# EAGLE design Esquema (EAGLE 9.6.2)
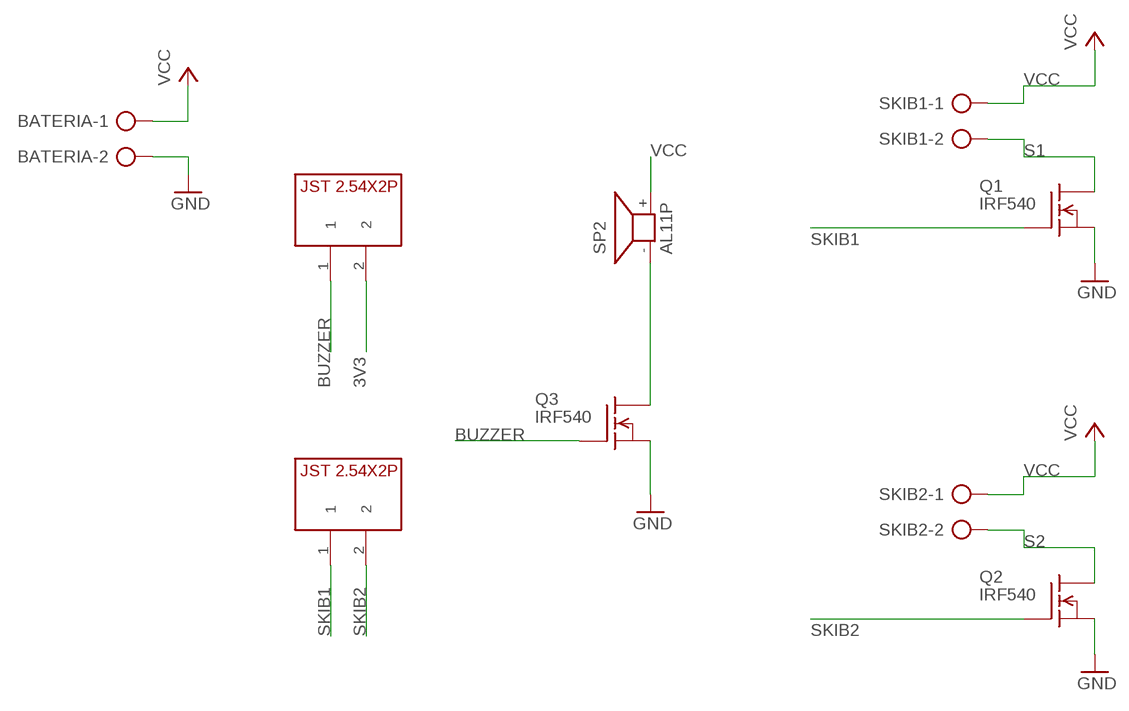
[diagram p0: schematic, sheet 1]

## Parts
BATERIA  AK500/2-H  [AK500/2-H]
Q1  IRF540  [TO220]
Q2  IRF540  [TO220]
Q3  IRF540  [TO220]
SKIB1  AK500/2-H  [AK500/2-H]
SKIB2  AK500/2-H  [AK500/2-H]
SP2  AL11P  [AL11P]
U$1  JST2.54X2P  [JST2.54X2P_FOOTPRINT]
U$2  JST2.54X2P  [JST2.54X2P_FOOTPRINT]

## Nets
3V3: U$1.2
BUZZER: Q3.1(G) U$1.1
GND: BATERIA.2 Q1.3(S) Q2.3(S) Q3.3(S)
N$2: Q3.2(D) SP2.-
S1: Q1.2(D) SKIB1.2
S2: Q2.2(D) SKIB2.2
SKIB1: Q1.1(G) U$2.1
SKIB2: Q2.1(G) U$2.2
VCC: BATERIA.1 SKIB1.1 SKIB2.1 SP2.+

## Library data of the parts
BATERIA SKIB1 SKIB2 = con-ptr500:AK500/2-H: CONNECTOR Aug. 2004 / PTR Meßtechnik: Die Bezeichnung der Serie AK505 wurde geändert. Es handelt sich hierbei um AK500 in horizontaler Ausführung.; OC_FARNELL: unknown; OC_NEWARK: unknown
Q1-Q3 = transistor-fet:IRF540: N-Channel Enhancement MOSFET (HEXFET); 100V; 28A; 0,077Ohm
SP2 = buzzer:AL11P: SPEAKER Source: Buerklin; OC_FARNELL: unknown; OC_NEWARK: unknown
U$1 U$2 = CRD:JST2.54X2P: Conector JST 2 pinos (2.54mm de distância entre pinos)

## Board
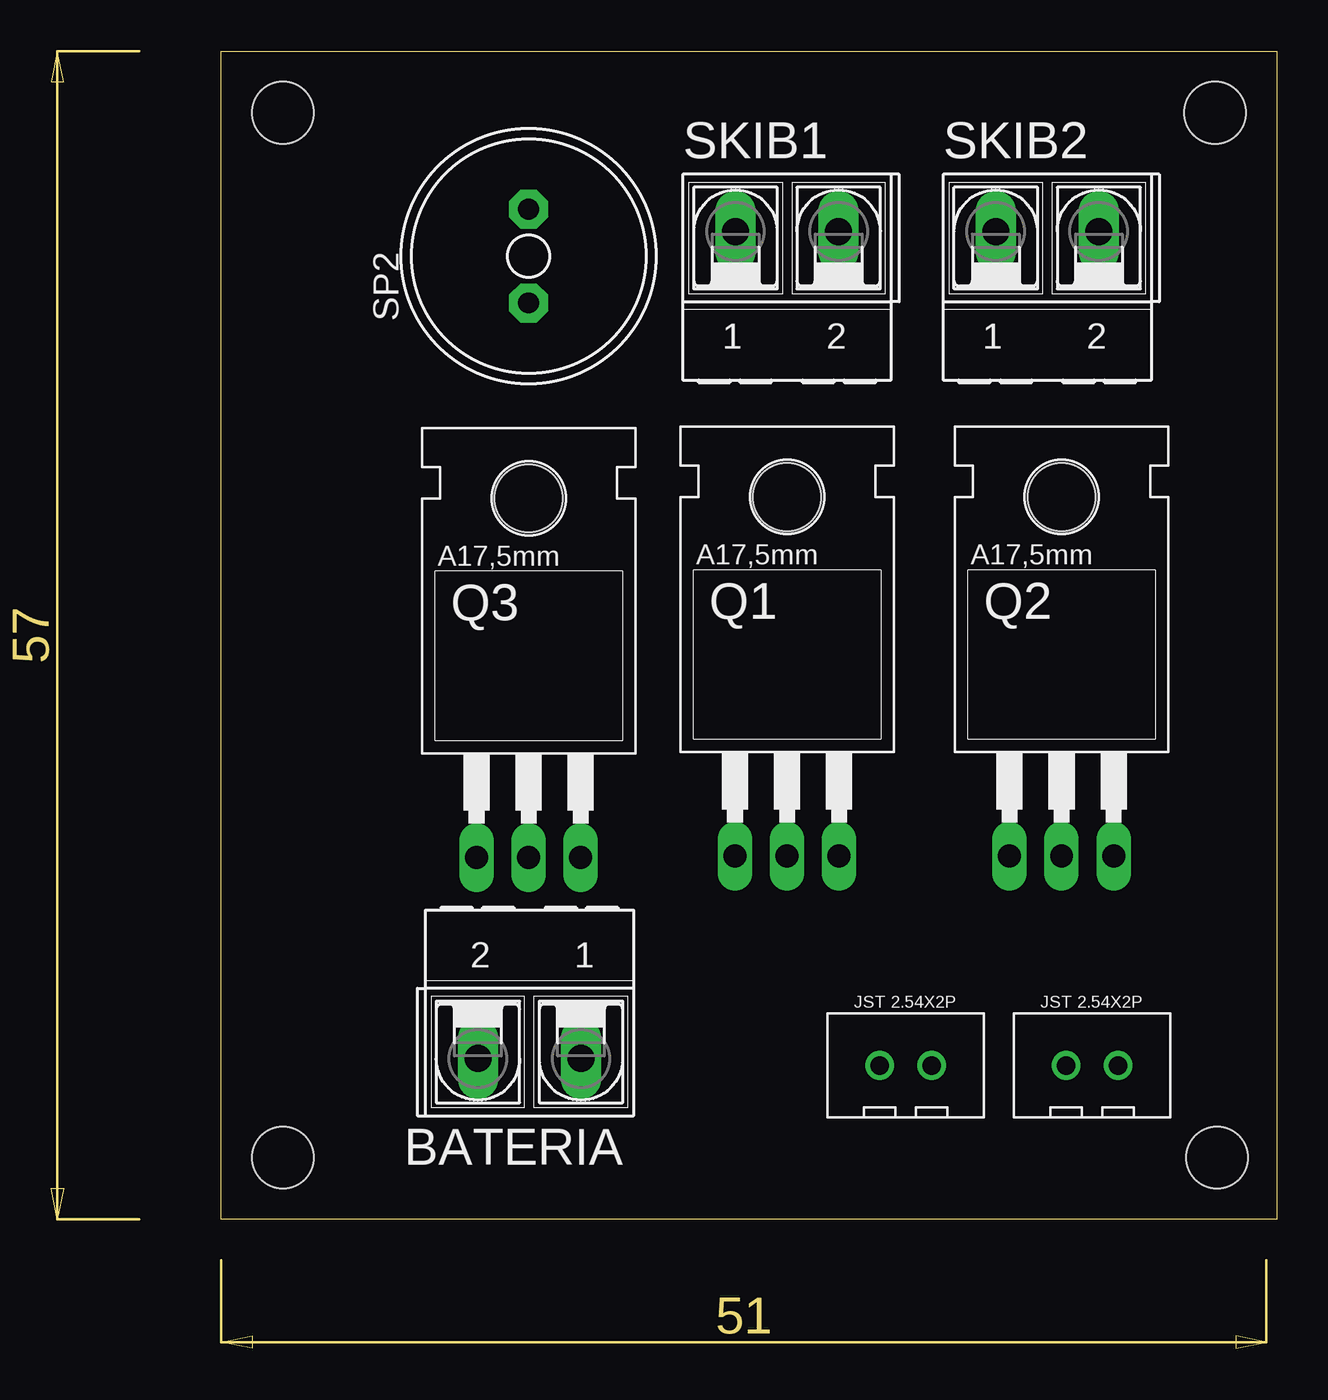
[diagram p1: board, top side]
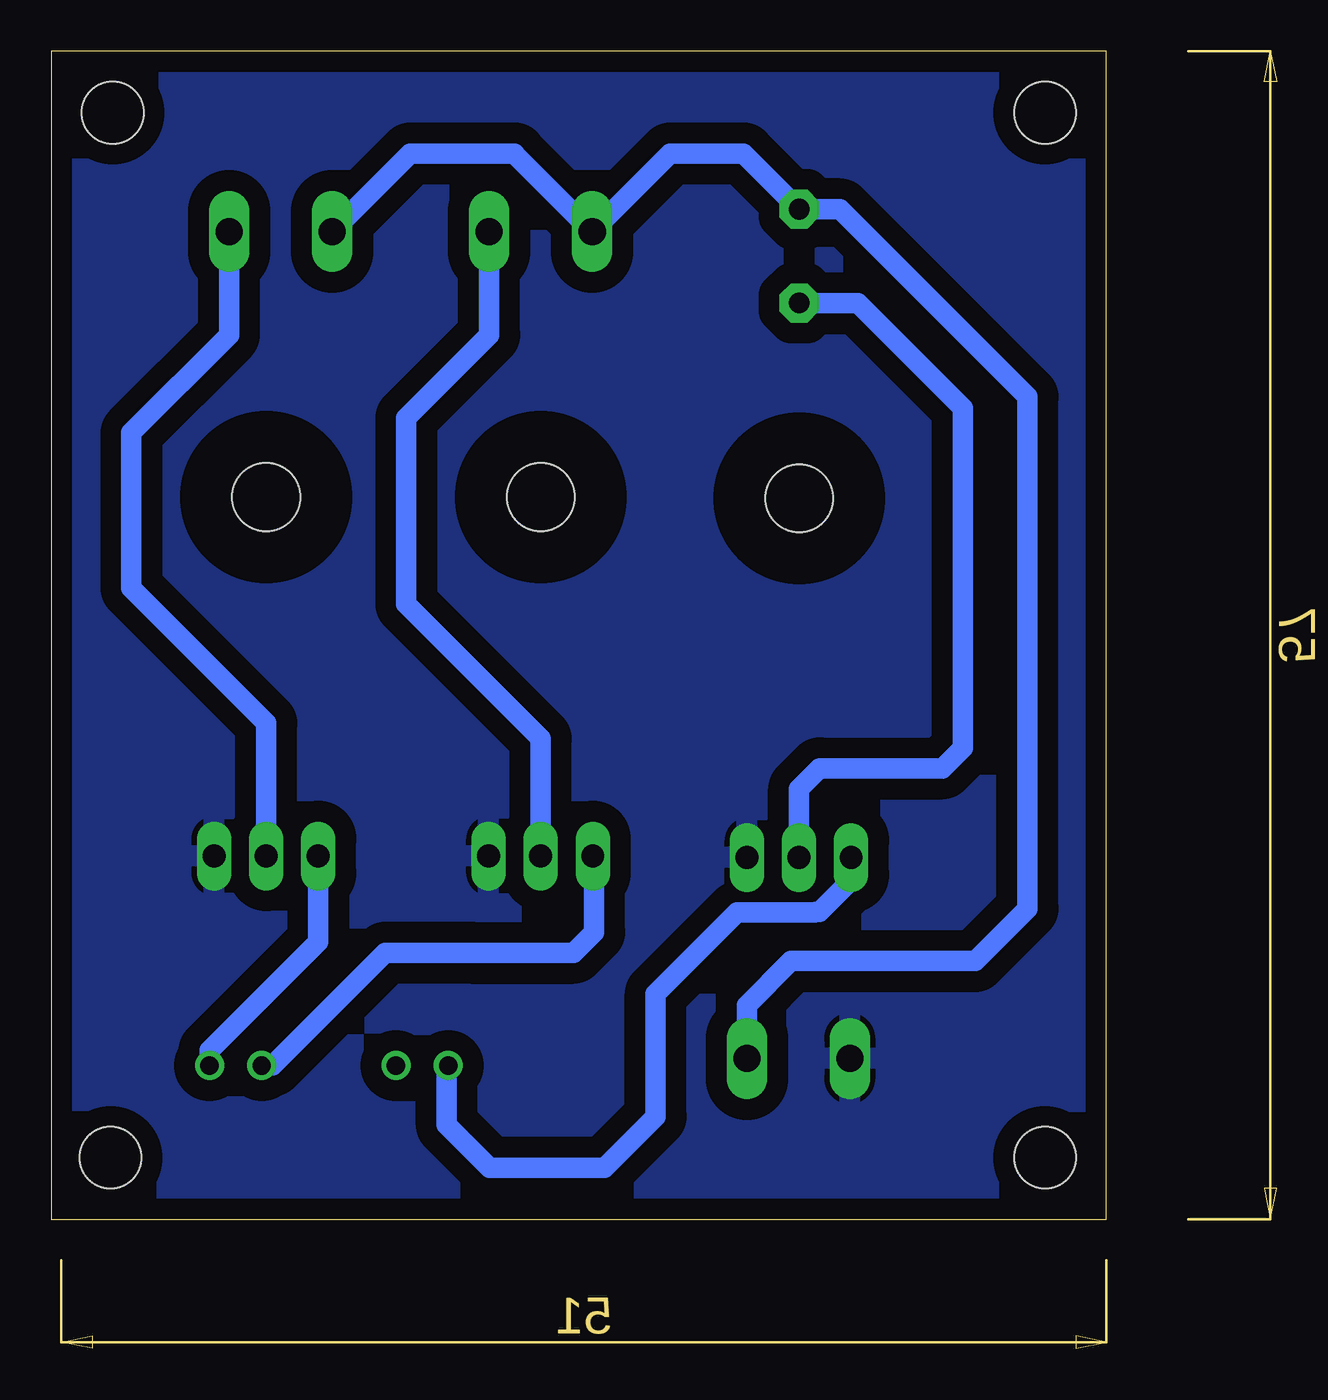
[diagram p2: board, bottom side, seen from below]

Size 51.5 x 57 mm. Coordinates in mm from the lower left corner, seen from the top.
Outline: 51.5,0 0,0 0,57 51.5,57 51.5,0
Copper layers (1*16): Top 0.035mm / dielectric 1.5mm / Bottom 0.035mm
Design rules "default *": minimum track width 1mm, minimum drill 0.35mm, track to track 40mil, track to pad 10mil, pad to pad 10mil, via to via 10mil, smd to smd 6mil, copper to edge 40mil, drill to drill 6mil, minimum pad ring 10mil, minimum via ring 8mil, stop-mask expansion 4mil, vias tented up to drill 0mil, thermal gap 10mil
Holes 3 mm at 3,54 48.5,54 3,3 48.6,3

### Footprints (pad centres in the part's own frame; a part is rotated, then mirrored left to right if it is on the bottom)
AK500/2-H = drill 1.321 long: 1 -2.515,0; 2 2.515,0
TO220 = drill 1.118 long: 1 -2.54,-6.35; 2 0,-6.35; 3 2.54,-6.35 | hole 3.302: 0,11.176
AL11P = drill 1.016 pad 1.905 octagon: + 2.286,0; - -2.286,0
JST2.54X2P_FOOTPRINT = drill 0.9: 1 -1.27,0; 2 1.27,0

### Placement (x,y rotation side)
BATERIA  15.04,7.84 180 top
Q1  27.61,24.07 0 top
Q2  41.01,24.07 0 top
Q3  15,24 0 top
SKIB1  27.61,48.2 0 top
SKIB2  40.31,48.2 0 top
SP2  15,47 90 top
U$1  33.4,7.5 0 top
U$2  42.5,7.5 0 top

### Tracks (layer width: path | path; a pad name or v marks a point on that pad's centre or on a via)
BUZZER
  Bottom 1: Q3.1 12.46,16.54 14,15 14.21,15 14.24,14.97 18.03,14.97 22,11 22,5 24.5,2.5 30.1,2.5 32.2,4.6 32.2,7.43 U$1.1
DS
  cutout Bottom: 44.6,40.1 45.4,39.3 45.4,39.1
GND
  pour Bottom: 51,56 51,1 1,1 1,56
N$2
  Bottom 1: Q3.2 15,21 14,22 8,22 7,23 7,39.58 12.13,44.71 SP2.-
S1
  Bottom 1: Q1.2 27.61,23.45 34.17,30.01 34.17,39.1 30.12,43.15 SKIB1.2
S2
  Bottom 1: Q2.2 41.01,24.21 47.59,30.79 47.59,38.38 42.83,43.15 SKIB2.2
SKIB1
  Bottom 1: Q1.1 25,17.65 25,14 26,13 31,13 35.2,13 40.7,7.5 U$2.1
SKIB2
  Bottom 1: Q2.1 38.47,13.53 43.77,8.23 U$2.2
VCC
  Bottom 1: SKIB2.1 33.98,52.01 28.88,52.01 28.88,51.98 SKIB1.1 21.3,52 17.71,52 SP2.+ 13,49.29 3.86,40.14 3.86,15.14 6.4,12.6 15.4,12.6 17.55,10.45 BATERIA.1